# EasyEDA Pro project ProProject_扫描隧道显微镜OpenSTM_2023-08-25.epro, schematic Sample_ConnectBoard
Create Date: 2022-12-13; Page Name: P1; Project Name: STM-New-Structure; Schematic Name: Schematic3; Update Date: 2022-12-13; Add into BOM: yes; Convert to PCB: yes
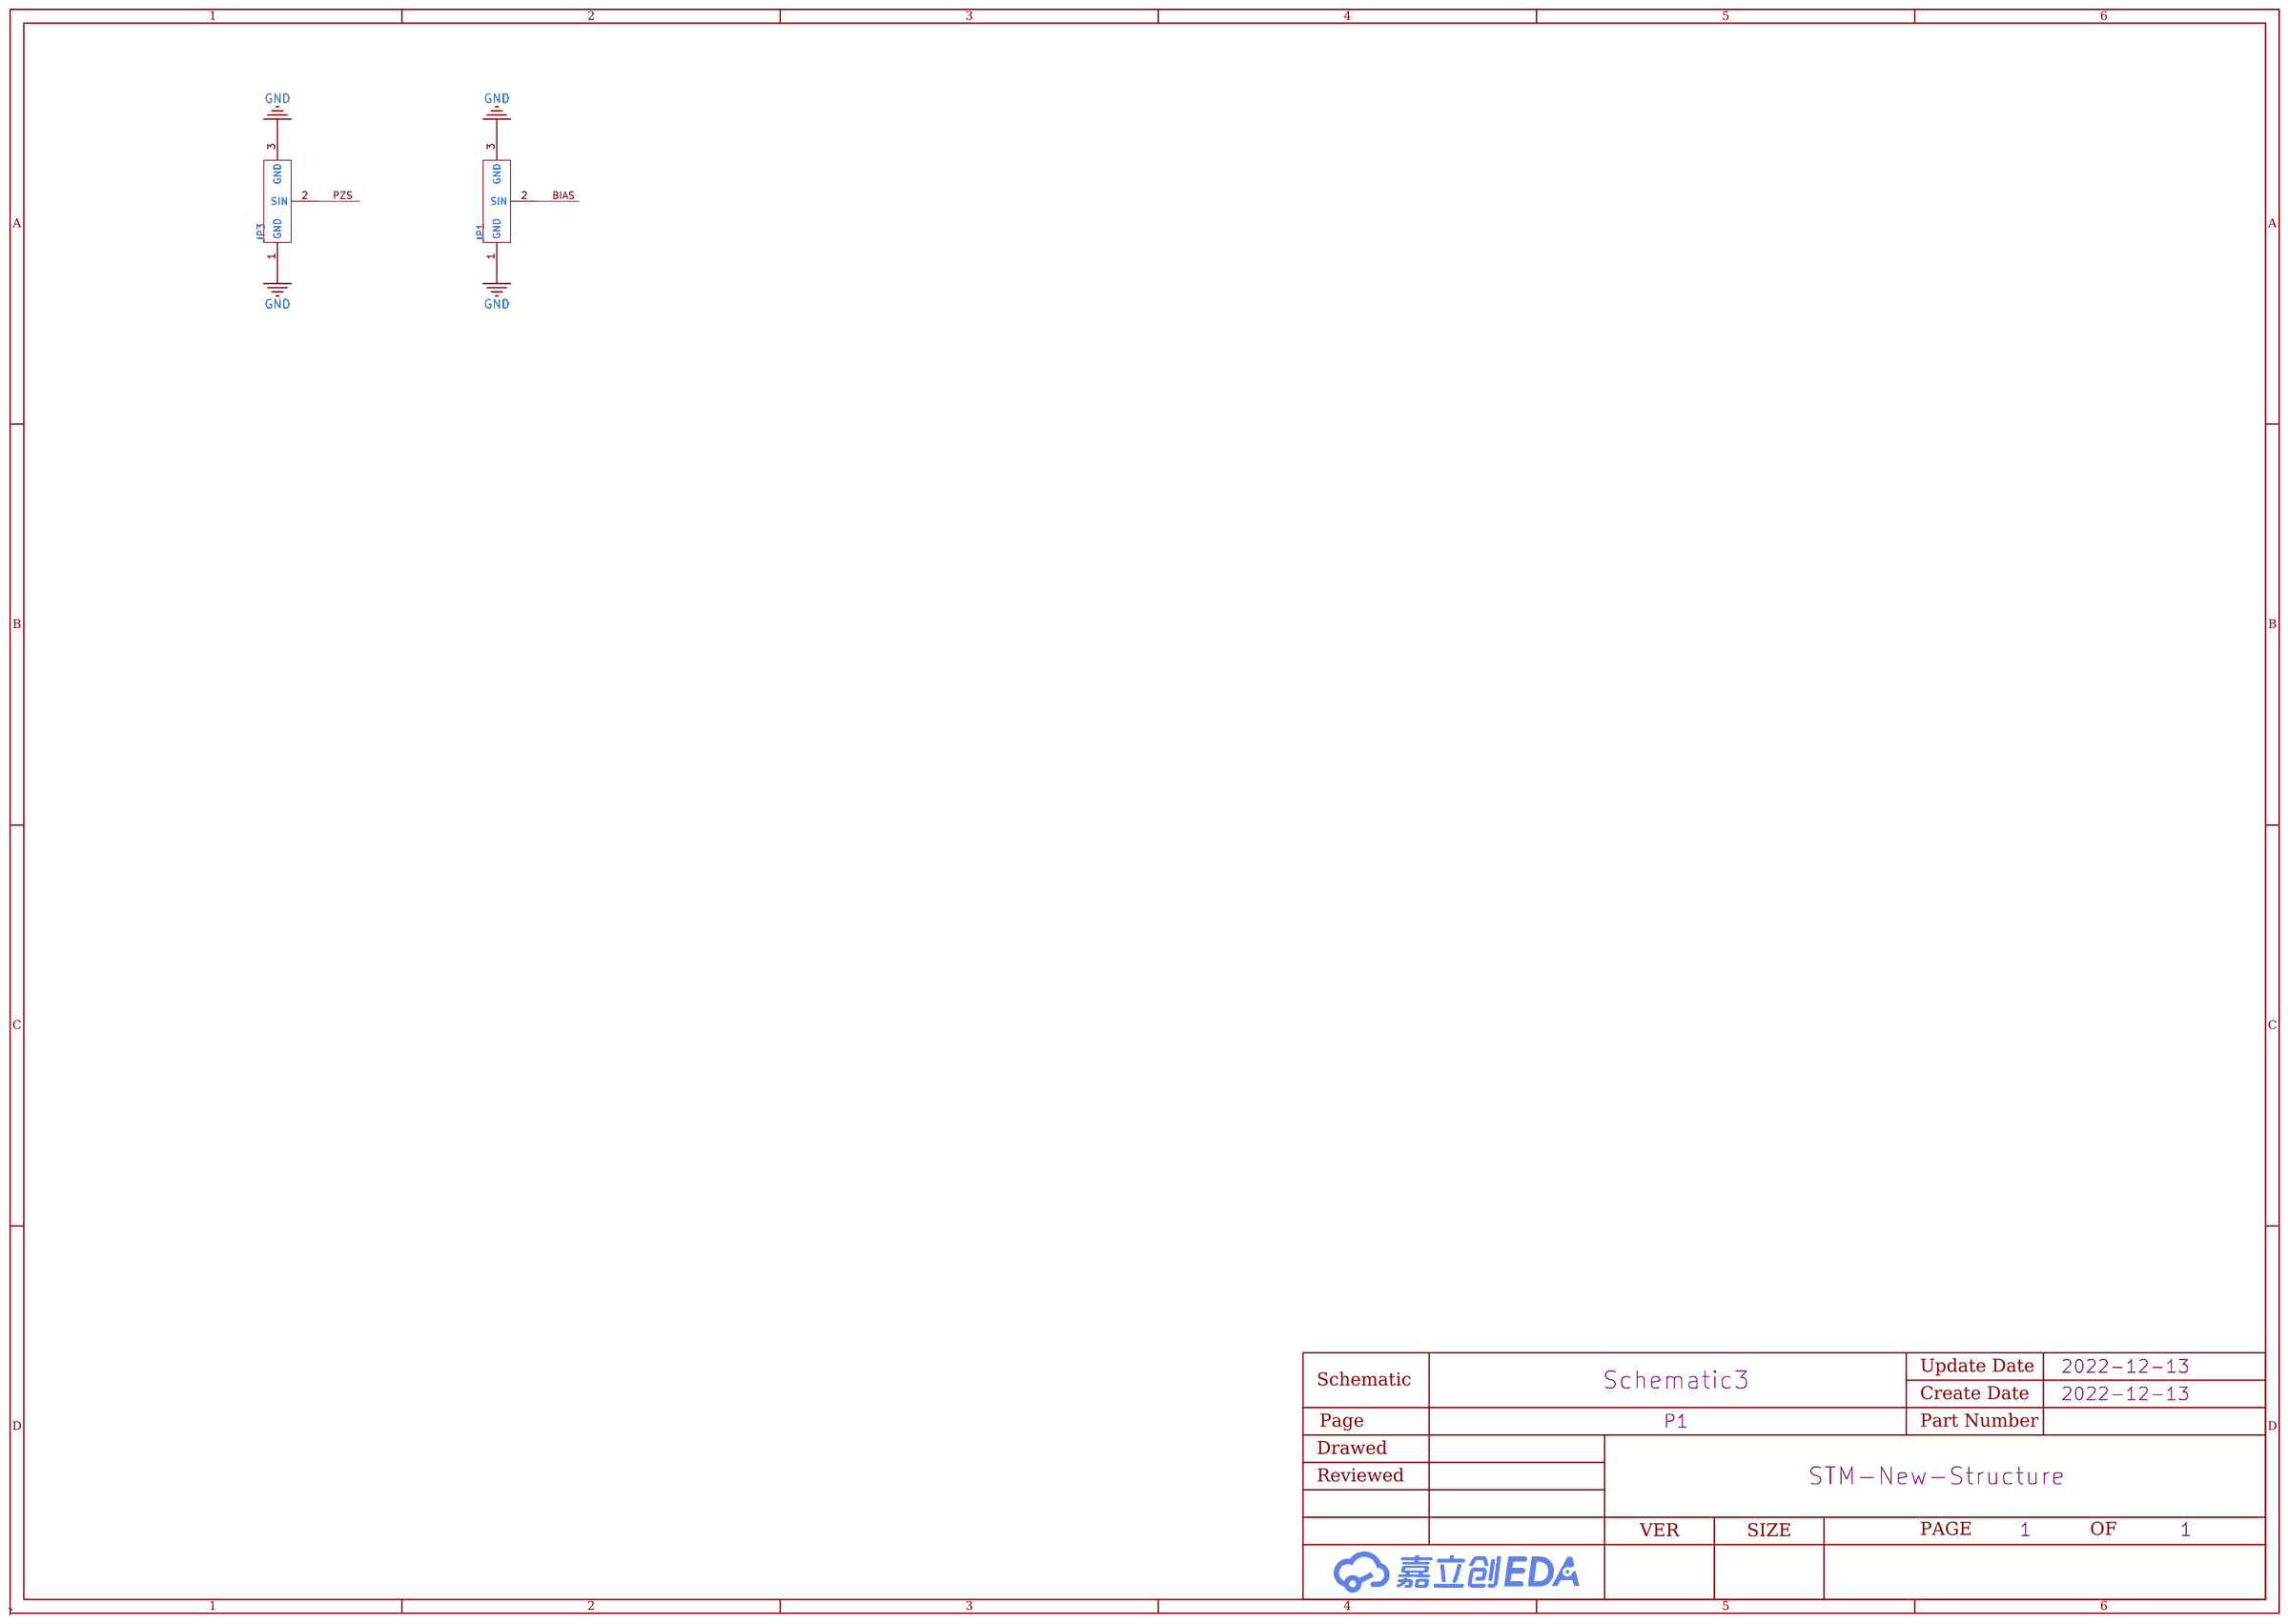
[diagram p5: schematic sheet]

## Parts
JP1  -  [ANT-SMD_UFL-R-SMT-1-10]
JP3  -  [ANT-SMD_UFL-R-SMT-1-10]

## Library data of the parts
JP1 JP3 = U.FL-R-SMT-1(10): 连接器类型:板端;射频系列:IPEX;接口类型:内针;端口数量:1;阻抗:50;频率-最大值:6GHz;样式:-;接口直径:2mm;接口长度/高度:1.25mm;工作温度范围:-40~+90;; LCSC Part Name: IPEX 内针; Supplier Part: C88373; Manufacturer: HRS(广濑); Supplier Footprint: SMD; JLCPCB Part Class: Extended Part; Datasheet: https://atta.szlcsc.com/upload/public/pdf/source/20170116/1484561244841.pdf; Supplier: LCSC; Connector Type: 板端; RF Series: IPEX; Interface Type: 内针; Number of Ports: 1; Impedance: 50; Frequency-Max: 6GHz; Interface Diameter: 2mm; Interface Length/Height: 1.25mm; Operating Temperature Range: -40~+90

## Nets
GND: JP1.1(GND) JP1.3(GND) JP3.1(GND) JP3.3(GND)
BIAS: JP1.2(SIN)
PZS: JP3.2(SIN)
